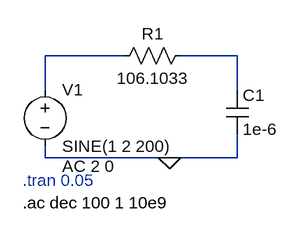
[diagram p0: schematic RC filter.asc]
RC filter.asc, the LTspice schematic file:
Version 4.1
SHEET 1 880 680
WIRE 80 64 -32 64
WIRE 240 64 160 64
WIRE -32 112 -32 64
WIRE 240 112 240 64
WIRE -32 208 -32 192
WIRE 144 208 -32 208
WIRE 240 208 240 176
WIRE 240 208 144 208
FLAG 144 208 0
SYMBOL voltage -32 96 R0
WINDOW 123 24 124 Left 2
WINDOW 39 0 0 Left 0
SYMATTR InstName V1
SYMATTR Value SINE(1 2 200)
SYMATTR Value2 AC 2 0
SYMBOL res 176 48 R90
WINDOW 0 0 56 VBottom 2
WINDOW 3 32 56 VTop 2
SYMATTR InstName R1
SYMATTR Value 106.1033
SYMBOL cap 224 112 R0
SYMATTR InstName C1
SYMATTR Value 1e-6
TEXT -64 240 Left 2 ;.tran 0.05
TEXT -64 272 Left 2 !.ac dec 100 1 10e9

The netlist it stands for:
* RC filter.asc
V1 N001 0 SINE(1 2 200) AC 2 0
R1 N002 N001 106.1033
C1 N002 0 1e-6
* .tran 0.05
.ac dec 100 1 10e9
.backanno
.end